# Altium schematic sheet INA219_CH2.SchDoc
size A4; SheetNumber: 5; SheetTotal: 9
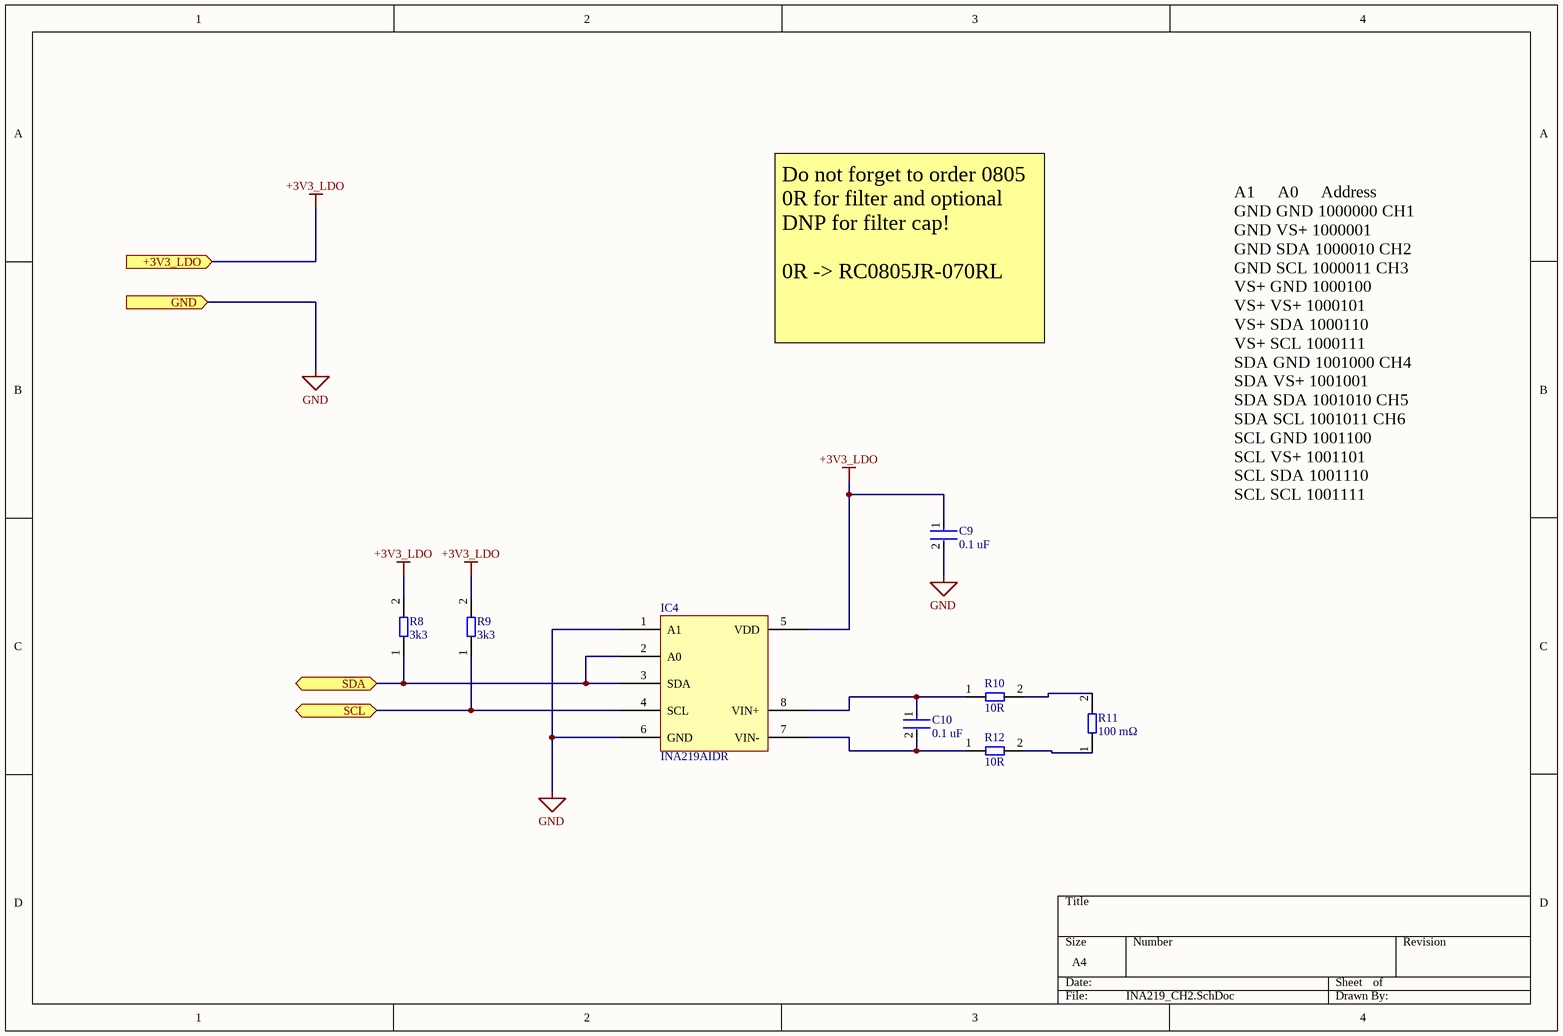
[diagram p0: INA219_CH2.SchDoc]

## Parts
C9  0.1 uF  [FP-C0805C-DN-MFG]
C10  0.1 uF  [FP-C0805C-DN-MFG]
IC4  INA219AIDR  [INA219AIDR]
R8  3k3  [0805 Resistor - IPC A]
R9  3k3  [0805 Resistor - IPC A]
R10  10R  [0805 Resistor - IPC A]
R11  100 mΩ  [PE2512FKM070R1L]
R12  10R  [0805 Resistor - IPC A]

## Ports
+3V3_LDO (in, see Callisto Control Board[3B], 3V3 LDO[3B], INA219_CH1[1A], INA219_CH3[1B], INA219_CH4[1B], INA219_CH5[1B], INA219_CH6[1B]), GND (in, see Callisto Control Board[3B], 3V3 LDO[3B], INA219_CH1[1A], INA219_CH3[1B], INA219_CH4[1B], INA219_CH5[1B], INA219_CH6[1B]), SCL (bidir, see Callisto Control Board[4B]), SDA (bidir, see Callisto Control Board[4B])

## Nets
+3V3_LDO: C9.1 IC4.5(VDD) R8.2 R9.2 ; port +3V3_LDO
GND: C9.2 IC4.1(A1) IC4.6(GND) ; port GND
SCL: IC4.4(SCL) R9.1 ; port SCL
SDA: IC4.2(A0) IC4.3(SDA) R8.1 ; port SDA
NetC10_1: C10.1 IC4.8(VIN+) R10.1
NetC10_2: C10.2 IC4.7(VIN-) R12.1
NetR10_2: R10.2 R11.2
NetR11_1: R11.1 R12.2

## Notes on the sheet
- Do not forget to order 0805 0R for filter and optional DNP for filter cap!
  0R -> RC0805JR-070RL
- A1     A0     Address
  GND GND 1000000 CH1
  GND VS+ 1000001
  GND SDA 1000010 CH2
  GND SCL 1000011 CH3
  VS+ GND 1000100
  VS+ VS+ 1000101
  VS+ SDA 1000110
  VS+ SCL 1000111
  SDA GND 1001000 CH4
  SDA VS+ 1001001
  SDA SDA 1001010 CH5
  SDA SCL 1001011 CH6
  SCL GND 1001100
  SCL VS+ 1001101
  SCL SDA 1001110
  SCL SCL 1001111

## Library data of the parts
C9 C10 = CMP-03020-002581-2: C0805 0.10 μF X7R 30ppm/°C 20.00% 50 V C0805C104M5RAC; Manufacturer: KEMET; Capacitance: 0.10 μF; Voltage Rating: 50 V; Value: 0.10 μF; Tolerance: 0.2; Material: Ceramic; Category: Cap; Temperature: -55°C to +125°C; Lead Free: Yes; Device Class L3: Ceramic Capacitors; Package: C0805C-DN; Height: 0.88mm; Temperature Range High: +125°C; Device Class L2: Capacitors; Manufacturer Part Number: C0805C104M5RAC; Device Class L1: Passive Components; Temperature Coefficient: 30ppm/°C; ComponentLink2Description: Datasheet; RoHS: TRUE; Temperature Range Low: -55°C; ComponentLink2URL: https://content.kemet.com/datasheets/KEM_C1003_C0G_SMD.pdf; Temperature Characteristic: X7R; Mouser Description: Multilayer Ceramic Capacitors MLCC - SMD/SMT 50volts 0.1uF 20% X7R; Octopart: https://octopart.com/c0805c104m5rac-kemet-2226142; Ipc Land Pattern Name: CAPC200125X78; Automotive: No
IC4 = INA219AIDR: Current & Power Monitors & Regulators Zero-Drift,Bi-Dir Crnt/Pwr Monitor
R8 R9 = RE0805FRE073K3L: Thick Film Resistors - SMD 3.3 kOhms 125 mW 0805 1% / RE0805FRE073K3L
R10 R12 = RC0805FR-0710RL: Thick Film Resistors - SMD 10 Ohms 125 mW 0805 1% / RC0805FR-0710RL
R11 = PE2512FKM070R1L: Current Sense Resistors - SMD 100 mOhms 1 Watt 1 % 75 ppm/C AEC-Q200 / PE2512FKM070R1L